# Altium schematic sheet Sheet1.SchDoc
size A2; Date: 2022/5/20; Author: WBN; DrawnBy: WBN; SheetNumber: 1; SheetTotal: 1
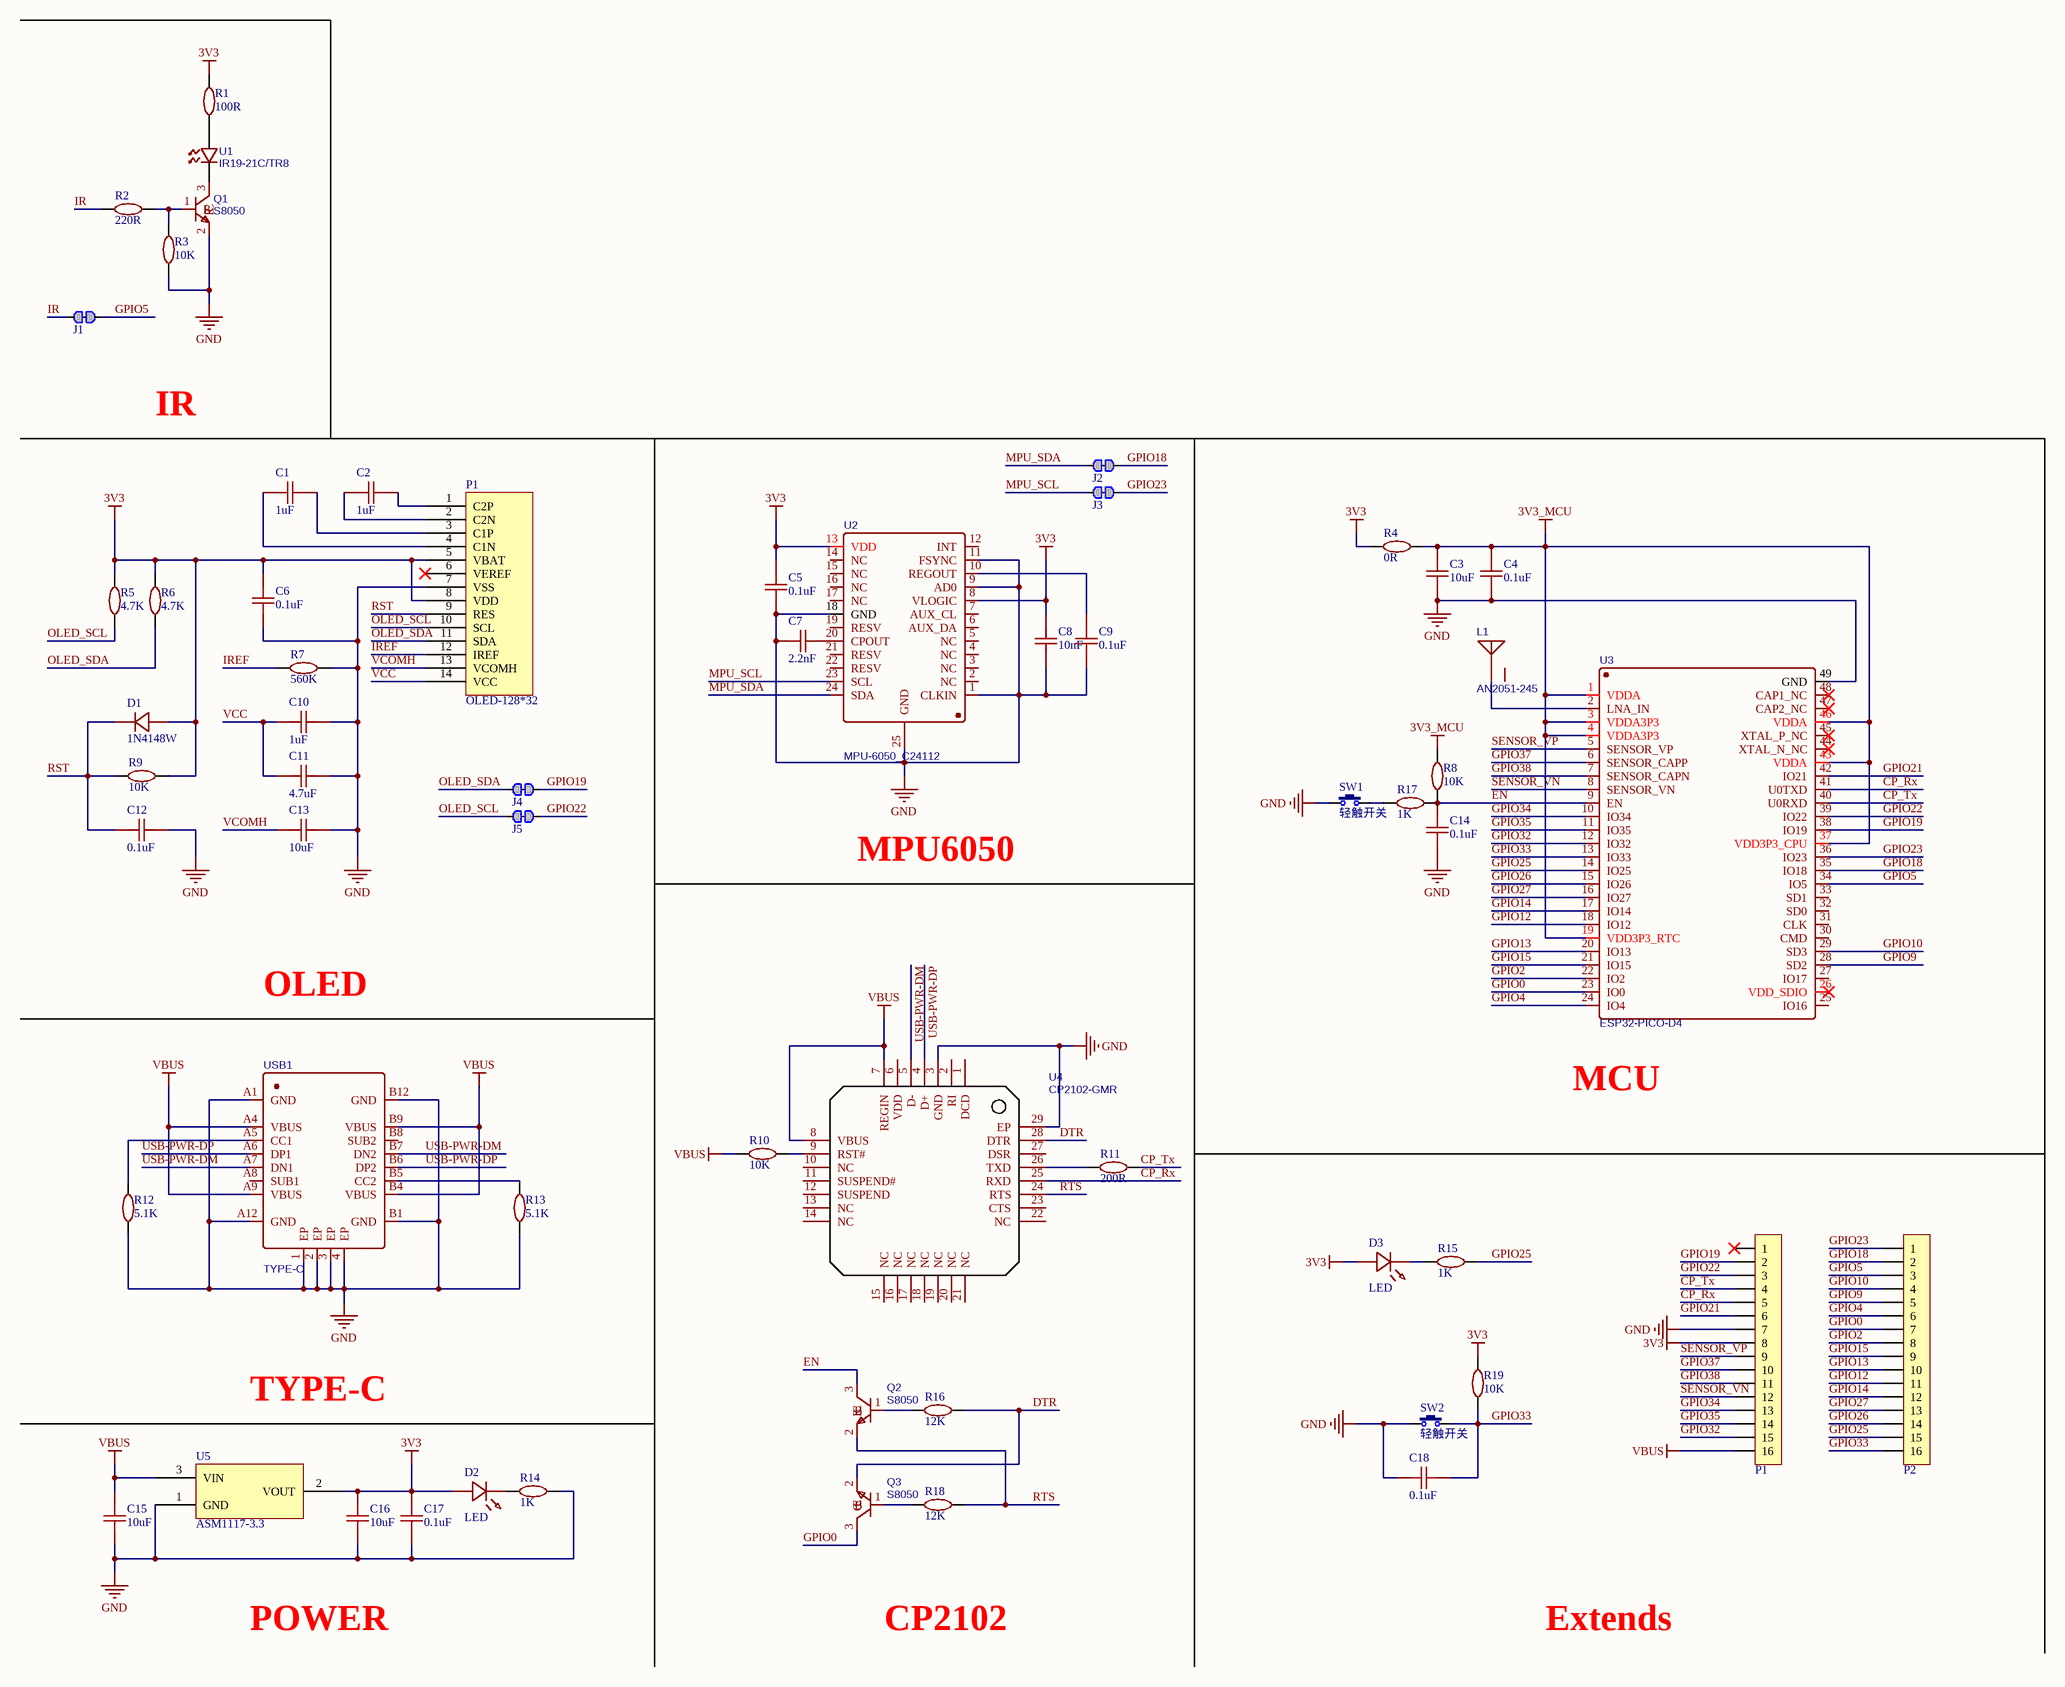
[diagram p0: Sheet1.SchDoc]

## Parts
(Parts that share a designator on the sheet are numbered #1, #2 ... from top to bottom, then left to right.)
C1  1uF  [C_0603]
C2  1uF  [C_0603]
C3  10uF  [C_0603]
C4  0.1uF  [C_0603]
C5  0.1uF  [C_0603]
C6  0.1uF  [C_0603]
C7  2.2nF  [C_0603]
C8  10nF  [C_0603]
C9  0.1uF  [C_0603]
C10  1uF  [C_0603]
C11  4.7uF  [C_0603]
C12  0.1uF  [C_0603]
C13  10uF  [C_0603]
C14  0.1uF  [C_0603]
C15  10uF  [C_0603]
C16  10uF  [C_0603]
C17  0.1uF  [C_0603]
C18  0.1uF  [C_0603]
D1  1N4148W  [SOD-123]
D2  LED  [LED_0603]
D3  LED  [LED_0603]
J1  跳线  [0402-0R]  (value not drawn)
J2  跳线  [0402-0R]  (value not drawn)
J3  跳线  [0402-0R]  (value not drawn)
J4  跳线  [0402-0R]  (value not drawn)
J5  跳线  [0402-0R]  (value not drawn)
L1  AN2051-245  [ANT2051]
P1#1  OLED-128*32  [OLED-128*32]
P1#2  排针-直-16P  [HDR2.54-LI-16P]  (value not drawn)
P2  排针-直-16P  [HDR2.54-LI-16P]  (value not drawn)
Q1  S8050  [SOT23]
Q2  S8050  [SOT23]
Q3  S8050  [SOT23]
R1  100R  [R_0603]
R2  220R  [R_0603]
R3  10K  [R_0603]
R4  0R  [R_0603]
R5  4.7K  [R_0603]
R6  4.7K  [R_0603]
R7  560K  [R_0603]
R8  10K  [R_0603]
R9  10K  [R_0603]
R10  10K  [R_0603]
R11  200R  [R_0603]
R12  5.1K  [R_0603]
R13  5.1K  [R_0603]
R14  1K  [R_0603]
R15  1K  [R_0603]
R16  12K  [R_0603]
R17  1K  [R_0603]
R18  12K  [R_0603]
R19  10K  [R_0603]
SW1  轻触开关  [ButtonTACT_3x4x2_180]
SW2  轻触开关  [ButtonTACT_3x4x2_180]
U1  IR19-21C/TR8  [LED_0603]
U2  MPU-6050_C24112  [QFN24 4x4_N]
U3  ESP32-PICO-D4  [QFN48 7X7_N]
U4  CP2102-GMR  [QFN28 5x5_N]
U5  ASM1117-3.3  [SOT-89]
USB1  TYPE-C  [USB-C-SMD_TYPE-C-USB-5]

## Nets
3V3: C5.2 C6.2 C8.2 C16.2 C17.2 D1.1(A) D2.1(A) D3.1(A) P1#1.5(VBAT) P1#1.8(VDD) P1#2.8 R1.1 R4.2 R5.2 R6.2 R9.2 R19.2 U2.8(VLOGIC) U2.13(VDD) U5.2(VOUT)
3V3_MCU: C3.2 C4.2 R4.1 R8.2 U3.1(VDDA) U3.3(VDDA3P3) U3.4(VDDA3P3) U3.19(VDD3P3_RTC) U3.37(VDD3P3_CPU) U3.43(VDDA) U3.46(VDDA)
GND: C3.1 C4.1 C5.1 C6.1 C7.1 C8.1 C9.1 C10.2 C11.2 C12.2 C13.2 C14.1 C15.1 C16.1 C17.1 C18.1 P1#1.7(VSS) P1#2.7 Q1.2(E) R3.2 R7.2 R12.1 R13.1 R14.2 SW1.1 SW2.1 U2.1(CLKIN) U2.9(AD0) U2.11(FSYNC) U2.18(GND) U2.25(GND) U3.49(GND) U4.3(GND) U4.29(EP) U5.1(GND) USB1.1(EP) USB1.2(EP) USB1.3(EP) USB1.4(EP) USB1.A1(GND) USB1.A12(GND) USB1.B1(GND) USB1.B12(GND)
VBUS: C15.2 P1#2.16 R10.1 U4.7(REGIN) U4.8(VBUS) U5.3(VIN) USB1.A4(VBUS) USB1.A9(VBUS) USB1.B4(VBUS) USB1.B9(VBUS)
CP_Rx: P1#2.5 U3.41(U0TXD) U4.25(RXD)
CP_Tx: P1#2.4 R11.2 U3.40(U0RXD)
DTR: Q3.2(E) R16.2 U4.28(DTR)
EN: C14.2 Q2.3(C) R8.1 R17.2 U3.9(EN)
GPIO0: P2.7 Q3.3(C) U3.23(IO0)
GPIO2: P2.8 U3.22(IO2)
GPIO4: P2.6 U3.24(IO4)
GPIO5: J1.2 P2.3 U3.34(IO5)
GPIO9: P2.5 U3.28(SD2)
GPIO10: P2.4 U3.29(SD3)
GPIO12: P2.11 U3.18(IO12)
GPIO13: P2.10 U3.20(IO13)
GPIO14: P2.12 U3.17(IO14)
GPIO15: P2.9 U3.21(IO15)
GPIO18: J2.2 P2.2 U3.35(IO18)
GPIO19: J4.2 P1#2.2 U3.38(IO19)
GPIO21: P1#2.6 U3.42(IO21)
GPIO22: J5.2 P1#2.3 U3.39(IO22)
GPIO23: J3.2 P2.1 U3.36(IO23)
GPIO25: P2.15 R15.2 U3.14(IO25)
GPIO26: P2.14 U3.15(IO26)
GPIO27: P2.13 U3.16(IO27)
GPIO32: P1#2.15 U3.12(IO32)
GPIO33: C18.2 P2.16 R19.1 SW2.2 U3.13(IO33)
GPIO34: P1#2.13 U3.10(IO34)
GPIO35: P1#2.14 U3.11(IO35)
GPIO37: P1#2.10 U3.6(SENSOR_CAPP)
GPIO38: P1#2.11 U3.7(SENSOR_CAPN)
IR: J1.1 R2.2
IREF: P1#1.12(IREF) R7.1
MPU_SCL: J3.1 U2.23(SCL)
MPU_SDA: J2.1 U2.24(SDA)
OLED_SCL: J5.1 P1#1.10(SCL) R5.1
OLED_SDA: J4.1 P1#1.11(SDA) R6.1
RST: C12.1 D1.2(K) P1#1.9(RES) R9.1
RTS: Q2.2(E) R18.2 U4.24(RTS)
SENSOR_VN: P1#2.12 U3.8(SENSOR_VN)
SENSOR_VP: P1#2.9 U3.5(SENSOR_VP)
USB-PWR-DM: U4.5(D-) USB1.A7(DN1) USB1.B7(DN2)
USB-PWR-DP: U4.4(D+) USB1.A6(DP1) USB1.B6(DP2)
VCC: C10.1 C11.1 P1#1.14(VCC)
VCOMH: C13.1 P1#1.13(VCOMH)
NetC1_1: C1.1 P1#1.3(C1P)
NetC1_2: C1.2 P1#1.4(C1N)
NetC2_1: C2.1 P1#1.1(C2P)
NetC2_2: C2.2 P1#1.2(C2N)
NetC7_2: C7.2 U2.20(CPOUT)
NetC9_2: C9.2 U2.10(REGOUT)
NetD2_2: D2.2(K) R14.1
NetD3_2: D3.2(K) R15.1
NetL1_1: L1.1(ANT) U3.2(LNA_IN)
NetQ1_1: Q1.1(B) R2.1 R3.1
NetQ1_3: Q1.3(C) U1.2(C)
NetQ2_1: Q2.1(B) R16.1
NetQ3_1: Q3.1(B) R18.1
NetR1_2: R1.2 U1.1(A)
NetR10_2: R10.2 U4.9(RST#)
NetR11_1: R11.1 U4.26(TXD)
NetR12_2: R12.2 USB1.A5(CC1)
NetR13_2: R13.2 USB1.B5(CC2)
NetR17_1: R17.1 SW1.2

Not connected (* = marked no-connect by the designer): L1 2; P1#1 6(VEREF)*; P1#2 1*; U2 2(NC) 3(NC) 4(NC) 5(NC) 6(AUX_DA) 7(AUX_CL) 12(INT) 14(NC) 15(NC) 16(NC) 17(NC) 19(RESV) 21(RESV) 22(RESV); U3 25(IO16) 26(VDD_SDIO)* 27(IO17) 30(CMD) 31(CLK) 32(SD0) 33(SD1) 44(XTAL_N_NC)* 45(XTAL_P_NC)* 47(CAP2_NC)* 48(CAP1_NC)*; U4 1(DCD) 2(RI) 6(VDD) 10(NC) 11(SUSPEND#) 12(SUSPEND) 13(NC) 14(NC) 15(NC) 16(NC) 17(NC) 18(NC) 19(NC) 20(NC) 21(NC) 22(NC) 23(CTS) 27(DSR); USB1 A8(SUB1) B8(SUB2)

## Notes on the sheet
- IR
- MPU6050
- OLED
- MCU
- TYPE-C
- POWER
- CP2102
- Extends

## Library data of the parts
C1-C18 = C_0603: 4.7nf-4.7uf
D1 = 1N4148W: 150mA/100V    开关二极管
D2 D3 = LED_0603
J1-J5 = 跳线: Resistor; Published: 8-Jun-2000; LatestRevisionDate: 17-Jul-2002; LatestRevisionNote: Re-released for DXP Platform.; PackageReference: AXIAL-0.4; Publisher: Altium Limited; PackageDescription: Axial Device, Thru-Hole; 2 Leads; 0.4 in Pin Spacing
L1 = AN2051-245: BOM_Manufacturer: Rainsun; BOM_Supplier: LCSC; BOM_Manufacturer Part: AN2051-245; BOM_Supplier Part: C99727; BOM_JLCPCB Part Class: Extended Part; spicePre: L; spiceSymbolName: AN2051-245
P1#2 P2 = 排针-直-16P: BOM名称: 16P接插件; 版权归属: 封装库来自淘宝卖家 ID：黄晶宝石; 学习资源: https://shop463601444.taobao.com
Q1-Q3 = S8050: BOM_Manufacturer: FOSAN(富信); Contributor: LCSC; BOM_Supplier: LCSC; BOM_Supplier Part: C2926165; BOM_Manufacturer Part: S8050; BOM_JLCPCB Part Class: Extended Part; spicePre: Q; spiceSymbolName: S8050_C2926165
R1-R19 = R_0603
SW1 SW2 = 轻触开关-3*4
U1 = IR19-21C/TR8: 红外发射管，波长940nm; BOM_Manufacturer: Everlight Elec; Contributor: LCSC; BOM_Supplier: LCSC; BOM_Supplier Part: C93768; BOM_Manufacturer Part: IR19-21C/TR8; BOM_JLCPCB Part Class: Extended Part; spicePre: U; spiceSymbolName: IR19-21C/TR8
U2 = MPU-6050: BOM_Manufacturer: InvenSense; sourceId: 1T5FDZYC8; timeStamp: 1462265206; BOM_Supplier: LCSC; BOM_Manufacturer Part: MPU-6050; BOM_Supplier Part: C24112; BOM_JLCPCB Part Class: Basic Part; spicePre: U; spiceSymbolName: MPU-6050_C24112
U3 = ESP32-PICO-D4: BOM_Manufacturer: Espressif Systems; Contributor: LCSC; BOM_Supplier: LCSC; BOM_Supplier Part: C193707; BOM_Manufacturer Part: ESP32-PICO-D4; BOM_JLCPCB Part Class: Extended Part; Frequency: -; spicePre: U; spiceSymbolName: ESP32-PICO-D4
U4 = CP2102-GMR: BOM_Manufacturer: SILICON LABS; BOM_Supplier: LCSC; BOM_Manufacturer Part: CP2102-GMR; BOM_Supplier Part: C6568; BOM_JLCPCB Part Class: Basic Part; spicePre: U; spiceSymbolName: CP2102-GMR
U5 = ASM1117-3.3: SOT-89封装
USB1 = TYPE-C: KH-TYPE-C-16P; BOM_Manufacturer: Shenzhen Kinghelm Elec; Contributor: LCSC; BOM_Supplier: LCSC; BOM_Supplier Part: C709357; BOM_Manufacturer Part: KH-TYPE-C-16P; BOM_JLCPCB Part Class: Extended Part; spicePre: U; spiceSymbolName: KH-TYPE-C-16P